# Altium schematic sheet TuneIt.SchDoc
size 431 x 279 mm; SheetNumber: 1; SheetTotal: 1; ENG_APP_DATE: --/--/--; DSN_APP_DATE: --/--/--; CHK_APP_DATE: --/--/--
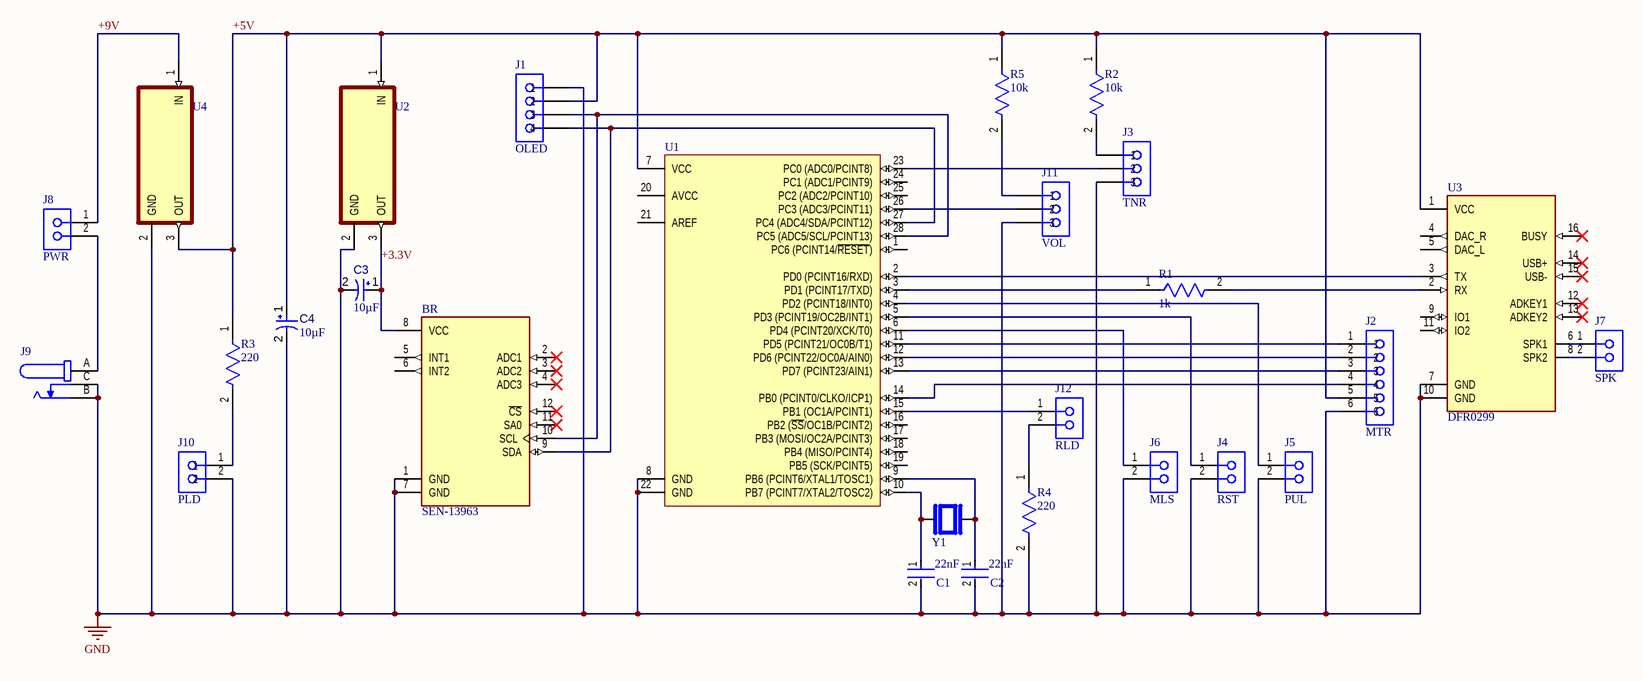
[diagram p0: TuneIt.SchDoc]

## Parts
BR  SEN-13963  [SEN-13963]
C1  22nF  [FP-RCE0DB-MFG]
C2  22nF  [FP-RCE0DB-MFG]
C3  value 10µF  [CAPPR55-200-1100X500X1200]  (hidden comment: ECA1HM100)
C4  value 10µF  [CAPPR55-200-1100X500X1200]  (hidden comment: ECA1HM100)
J1  OLED  [61300411821]
J2  MTR  [61300611821]
J3  TNR  [61300311821]
J4  RST  [61300211821]
J5  PUL  [61300211821]
J6  MLS  [61300211821]
J7  SPK  [61300211821]
J8  PWR  [61300211821]
J9  54-00130  [TENSILITY_54-00130]  (value not drawn)
J10  PLD  [61300211821]
J11  VOL  [61300311821]
J12  RLD  [61300211821]
R1  Resistance: 1k  [FP-VR37-MFG]  (hidden comment: VR37000001204JA100)
R2  Resistance: 10k  [FP-VR37-MFG]  (hidden comment: VR37000001204JA100)
R3  Resistance: 220  [FP-VR37-MFG]  (hidden comment: VR37000001204JA100)
R4  Resistance: 220  [FP-VR37-MFG]  (hidden comment: VR37000001204JA100)
R5  Resistance: 10k  [FP-VR37-MFG]  (hidden comment: VR37000001204JA100)
U1  ATMEGA328P-PU  [ATML-28P3]  (value not drawn)
U2  LM2937ET-3.3/NOPB  [TO254P1054X470X1955-3]  (value not drawn)
U3  DFR0299  [MODULE_DFR0299]
U4  LM2937ET-3.3/NOPB  [TO254P1054X470X1955-3]  (value not drawn)
Y1  ABL-16.000MHz-B1U-T  [XTAL_HC49P488W46L1150T500H350]  (value not drawn)

## Nets
GND: BR.1(GND) BR.7(GND) C1.2 C2.2 C3.2 C4.2 J1.1 J2.6 J3.3 J4.2 J5.2 J6.2 J9.B J9.C J10.2 J11.3 R4.2 U1.8(GND) U1.22(GND) U2.2(GND) U3.7(GND) U3.10(GND) U4.2(GND)
+3.3V: BR.8(VCC) C3.1 U2.3(OUT)
+5V: C4.1 J1.2 J2.5 R2.1 R3.1 R5.1 U1.7(VCC) U2.1(IN) U3.1(VCC) U4.3(OUT)
+9V: J8.1 U4.1(IN)
NetBR_9: BR.9(SDA) J1.4 U1.27(PC4_(ADC4/SDA/PCINT12))
NetBR_10: BR.10(SCL) J1.3 U1.28(PC5_(ADC5/SCL/PCINT13))
NetC1_1: C1.1 U1.10(PB7_(PCINT7/XTAL2/TOSC2)) Y1.2
NetC2_1: C2.1 U1.9(PB6_(PCINT6/XTAL1/TOSC1)) Y1.1
NetJ2_1: J2.1 U1.11(PD5_(PCINT21/OC0B/T1))
NetJ2_2: J2.2 U1.12(PD6_(PCINT22/OC0A/AIN0))
NetJ2_3: J2.3 U1.13(PD7_(PCINT23/AIN1))
NetJ2_4: J2.4 U1.14(PB0_(PCINT0/CLKO/ICP1))
NetJ3_1: J3.1 R2.2
NetJ3_2: J3.2 U1.23(PC0_(ADC0/PCINT8))
NetJ4_1: J4.1 U1.5(PD3_(PCINT19/OC2B/INT1))
NetJ5_1: J5.1 U1.4(PD2_(PCINT18/INT0))
NetJ6_1: J6.1 U1.6(PD4_(PCINT20/XCK/T0))
NetJ7_1: J7.1 U3.6(SPK1)
NetJ7_2: J7.2 U3.8(SPK2)
NetJ8_2: J8.2 J9.A
NetJ10_1: J10.1 R3.2
NetJ11_1: J11.1 R5.2
NetJ11_2: J11.2 U1.26(PC3_(ADC3/PCINT11))
NetJ12_1: J12.1 U1.15(PB1_(OC1A/PCINT1))
NetJ12_2: J12.2 R4.1
NetR1_1: R1.1 U1.3(PD1_(PCINT17/TXD))
NetR1_2: R1.2 U3.2(RX)
NetU1_2: U1.2(PD0_(PCINT16/RXD)) U3.3(TX)

Not connected (* = marked no-connect by the designer): BR 2(ADC1)* 3(ADC2)* 4(ADC3)* 5(INT1) 6(INT2) 11(SA0)* 12(~{CS})*; U1 1(PC6_(PCINT14/~{RESET})) 16(PB2_(~{SS}/OC1B/PCINT2)) 17(PB3_(MOSI/OC2A/PCINT3)) 18(PB4_(MISO/PCINT4)) 19(PB5_(SCK/PCINT5)) 20(AVCC) 21(AREF) 24(PC1_(ADC1/PCINT9)) 25(PC2_(ADC2/PCINT10)); U3 4(DAC_R) 5(DAC_L) 9(IO1) 11(IO2) 12(ADKEY1)* 13(ADKEY2)* 14(USB+)* 15(USB-)* 16(BUSY)*

## Notes on the sheet
- 8
- 7
- 6
- 5
- 4
- 3
- DWG. NO.
- REV.
- SHT.
- 2
- 1
- THIS DOCUMENT AND THE DATA DISCLOSED HEREIN OR HEREWITH IS THE PROPERTY OF ALTIUM LIMITED AND MAY BE FREELY DISTRIBUTED IN WHOLE. NO RIGHTS ARE RESERVED OR EXPRESS OR IMPLIED WARANTEE GIVEN.
- REVISION
- DESCRIPTION
- DATE
- APPROVED
- F
- E
- D
- C
- B
- A
- TITLE
- SCALE:
- SIZE
- CAGE CODE
- FILE NAME
- DWG NO.
- SHEET
- OF
- REV

## Library data of the parts
BR = CMP-122-000000-1: LIS3DH - Accelerometer, 3 Axis Sensor Evaluation Board; MF: SparkFun Electronics; Value: *; Design Item ID: SEN-13963; Availability: Unavailable; Pin Count: 12; Package: None; Source: SnapEDAsch.SchLib; Price: None; SnapEDA_Link: https://www.snapeda.com/parts/SEN-13963/SparkFun%20Electronics/view-part/666571/?ref=snap; Component Type: Standard; MP: SEN-13963
C1 C2 = CMP-001-00091-1: CAP CER 10000PF 50V X7R RADIAL
C3 C4 = CMP-001-00025-5: Aluminum Electrolytic Capacitor, 10 uF, +/- 20%, 50 V, -40 to 85 degC, 2-Pin THD, RoHS, Bulk; Manufacturer: Panasonic; Ripple Current (AC): 65mA; Voltage Rating: 50V; Min Operating Temperature: -40°C; RoHS Compliant: True; Packaging: Bulk; Pins: 2; Case/Package: Radial; Datasheet URL: https://industrial.panasonic.com/cdbs/www-data/pdf/RDF0000/ABA0000C1218.pdf; Tolerance: 20%; Ripple Current: 65mA; Capacitor Type: Electrolytic; Lead Pitch: 2mm; Max Operating Temperature: 85°C; Package Description: 2-Pin Radial Lead, Dia 5 mm, Height 12 mm; Mounting Technology: TH; Diameter: 5mm; Package Reference: CAPPR55-200-1100X500X1200; Datasheet Version: Rev. 05, 10/2016; Manufacturer URL: http://www.panasonic.com/; Package Quantity: 200
J1 = CMP-002-00261-1: WR-PHD Socket Header, THT, Vertical, pitch 2.54mm, 1 Row, 4P; Manufacturer: Wurth Elektronik; Withstanding Voltage: 500V; Working Voltage: 250V; Rated Current: 3A; Contact Resistance: 20mOhm; Source: WR-PHD.SchLib; Match Code: WR-PHD; Operating Temperature Min: -40°C; Operating Temperature Max: 125°C; ComponentLink1URL: https://www.we-online.com/redexpert/article/61300411821?ad; Component Type: Standard; Category: Board-to-Board Connectors; Orientation: Vertical; ComponentLink2Description: Datasheet Link; ComponentLink1Description: Website Link; Design Item ID: 61300411821; Gender: Socket Header; Manufacturer Part Number: 61300411821; Number of Rows: 1; ComponentLink2URL: https://www.we-online.com/redexpert/spec/61300411821?ad; Pitch: 2.54mm; Mount: Through Hole; Packaging: Tray; Pin Count: 4; Pins: 4
J2 = CMP-002-00277-1: WR-PHD Socket Header, THT, Vertical, pitch 2.54mm, 1 Row, 6P; Manufacturer: Wurth Elektronik; Working Voltage: 250V; Rated Current: 3A; Contact Resistance: 20mOhm; Withstanding Voltage: 500V; Gender: Socket Header; Mount: Through Hole; Orientation: Vertical; Number of Rows: 1; Pins: 6; ComponentLink2Description: Datasheet Link; Component Type: Standard; Manufacturer Part Number: 61300611821; Source: WR-PHD.SchLib; ComponentLink2URL: https://www.we-online.com/redexpert/spec/61300611821?ad; Pin Count: 6; Design Item ID: 61300611821; Match Code: WR-PHD; Operating Temperature Max: 125°C; ComponentLink1URL: https://www.we-online.com/redexpert/article/61300611821?ad; Packaging: Tray; ComponentLink1Description: Website Link; Pitch: 2.54mm; Category: Board-to-Board Connectors; Operating Temperature Min: -40°C
J3 J11 = CMP-002-00257-1: WR-PHD Socket Header, THT, Vertical, pitch 2.54mm, 1 Row, 3P; Manufacturer: Wurth Elektronik; Withstanding Voltage: 500V; Rated Current: 3A; Contact Resistance: 20mOhm; Working Voltage: 250V; Source: WR-PHD.SchLib; ComponentLink2Description: Datasheet Link; Match Code: WR-PHD; Packaging: Tray; ComponentLink1Description: Website Link; Operating Temperature Max: 125°C; Pin Count: 3; Number of Rows: 1; ComponentLink2URL: https://www.we-online.com/redexpert/spec/61300311821?ad; Orientation: Vertical; ComponentLink1URL: https://www.we-online.com/redexpert/article/61300311821?ad; Category: Board-to-Board Connectors; Pins: 3; Gender: Socket Header; Design Item ID: 61300311821; Pitch: 2.54mm; Manufacturer Part Number: 61300311821; Mount: Through Hole; Component Type: Standard; Operating Temperature Min: -40°C
J4-J8 J10 J12 = CMP-002-00253-1: WR-PHD Socket Header, THT, Vertical, pitch 2.54mm, 1 Row, 2P; Manufacturer: Wurth Elektronik; Contact Resistance: 20mOhm; Withstanding Voltage: 500V; Rated Current: 3A; Working Voltage: 250V; Orientation: Vertical; Pitch: 2.54mm; Design Item ID: 61300211821; Number of Rows: 1; ComponentLink2URL: https://www.we-online.com/redexpert/spec/61300211821?ad; Operating Temperature Max: 125°C; Pin Count: 2; Manufacturer Part Number: 61300211821; ComponentLink2Description: Datasheet Link; Mount: Through Hole; Pins: 2; Gender: Socket Header; Category: Board-to-Board Connectors; Source: WR-PHD.SchLib; Operating Temperature Min: -40°C; ComponentLink1Description: Website Link; Match Code: WR-PHD; Packaging: Tray; Component Type: Standard; ComponentLink1URL: https://www.we-online.com/redexpert/article/61300211821?ad
J9 = CMP-002-01141-1: Connector, dc jack 5.5x2.5 mm, PCB mount, 90 degrees, silver plated, thru hole; MF: Tensility International Corp; MP: 54-00130; Availability: In Stock; Price: None; Value: *; Check_prices: https://www.snapeda.com/parts/54-00130/Tensility+International+Corp/view-part/?ref=eda; SnapEDA_Link: https://www.snapeda.com/parts/54-00130/Tensility+International+Corp/view-part/?ref=snap; Design Item ID: 54-00130; Case/Package: None; Purchase-URL: https://pricing.snapeda.com/search?q=54-00130&ref=eda; Component Type: Standard; Source: 54-00130.SchLib; Pins: 3
R1-R5 = CMP-02408-000054-1: RES 1.2M OHM 5% 1/2W AXIAL; Voltage Rating: 3.5kV; Power Rating: 500mW; Temperature Coefficient: 200ppm/°C; Diameter: 4mm; Max Operating Temperature: 155°C; Military Standard: Not; Reach SVHC Compliant: Yes; Min Operating Temperature: -55°C; Resistance Tolerance: 5%; Resistor Type: Metal Film; Tolerance: 5%; Mount: Through Hole; Construction: Cylindrical; Contact Plating: Tin; Length: 10mm; Termination: Axial; Voltage Rating (DC): 3.5kV; Packaging: Ammo Pack; Radiation Hardening: No; Case/Package: Conformal
U1 = CMP-020-00004-2: 8-Bit Microcontroller with 32 KBytes In-System Programmable Flash, 23 I/Os, -40 to 85 degC, 28-Pin PDIP (28P3), RoHS, Tube; Manufacturer: Atmel; Max Supply Voltage: 5.5V; Density: 32KB; Package Version: Rev. B, 09/2001; Max Clock Frequency: 20MHz; I/Os: 23; Ethernet Channels: 0; Min Supply Voltage: 1.8V; RAM Size: 2KB; Interface: USART; Case/Package: DIP; Packaging: Rail/Tube; Datasheet Version: Rev. 8271J, 11/2015; Max Operating Temperature: 85°C; Datasheet URL: http://www.atmel.com/images/Atmel-8271-8-bit-AVR-Microcontroller-ATmega48A-48PA-88A-88PA-168A-168PA-328-328P_datasheet_Complete.pdf; Package Reference: 28P3; Package URL: http://www.atmel.com/images/Atmel-8271-8-bit-AVR-Microcontroller-ATmega48A-48PA-88A-88PA-168A-168PA-328-328P_datasheet_Complete.pdf; Min Operating Temperature: -40°C; Manufacturer URL: http://www.atmel.com/; Package Description: 28-Pin Plastic Dual Inline Package, Body 34.671 x 7.3025 mm, Pitch 2.54 mm; Pins: 28; Package Quantity: 14; RoHS Compliant: True; Mounting Technology: TH
U2 U4 = CMP-124-000000-1: Value: *; Package: None; MP: LM2937ET-3.3/NOPB; Pin Count: 3; Source: LM2937ET-3.3_NOPB.SchLib; Component Type: Standard; Availability: Unavailable; Design Item ID: LM2937ET-3.3/NOPB; Price: None
U3 = CMP-136-000000-1: - MP3 Player Audio Arduino Platform Evaluation Expansion Board; MF: DFRobot; Package: None; Check_prices: https://www.snapeda.com/parts/DFR0299/DFRobot/view-part/?ref=eda; MP: DFR0299; Value: *; Design Item ID: DFR0299; SnapEDA_Link: https://www.snapeda.com/parts/DFR0299/DFRobot/view-part/?ref=snap; Source: DFR0299.SchLib; Component Type: Standard; Pin Count: 16
Y1 = CMP-003-00030-1: 16 MHz Â±10ppm Crystal 18pF 40 Ohms HC-49/US; MF: Abracon LLC; Availability: In Stock; Check_prices: https://www.snapeda.com/parts/ABL-16.000MHz-B1U/Abracon+LLC/view-part/?ref=eda; Pins: 2; Component Type: Standard; Source: ABL-16.000MHz-B1U-T.SchLib; Purchase-URL: https://pricing.snapeda.com/search/part/ABL-16.000MHz-B1U/?ref=eda; Value: *; SnapEDA_Link: https://www.snapeda.com/parts/ABL-16.000MHz-B1U/Abracon+LLC/view-part/?ref=snap; MP: ABL-16.000MHz-B1U; Design Item ID: ABL-16.000MHz-B1U-T; Price: None; Case/Package: HC-49/US ABRACON